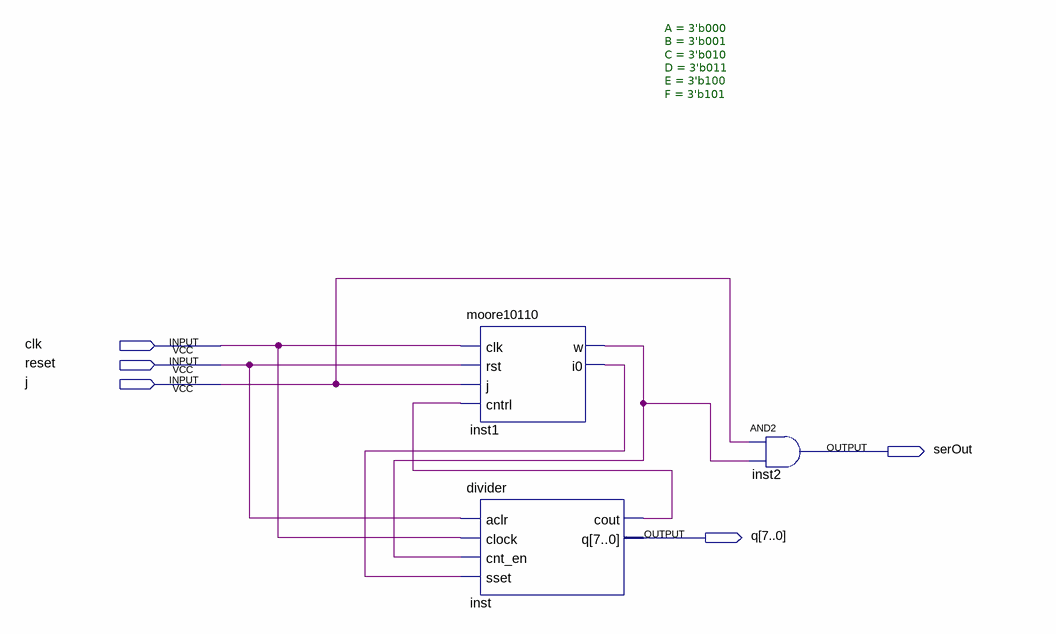
[diagram p0: schematic sheet]
// Quartus schematic Orthogonal.bdf as structural Verilog: 3 symbols, 5 pins
module Orthogonal (
  input  clk,
  input  reset,
  input  j,
  output serOut,
  output [7:0] q
);

  wire inst1_i0, inst1_w, inst_cout;

  moore10110 #(.A(3'b000), .B(3'b001), .C(3'b010), .D(3'b011), .E(3'b100), .F(3'b101)) inst1 (
    .clk(clk), .rst(reset), .j(j), .cntrl(inst_cout), .w(inst1_w), .i0(inst1_i0));
  divider inst (.aclr(reset), .clock(clk), .cnt_en(inst1_w), .sset(inst1_i0), .cout(inst_cout), .q(q));
  and inst2 (serOut, j, inst1_w);
endmodule
